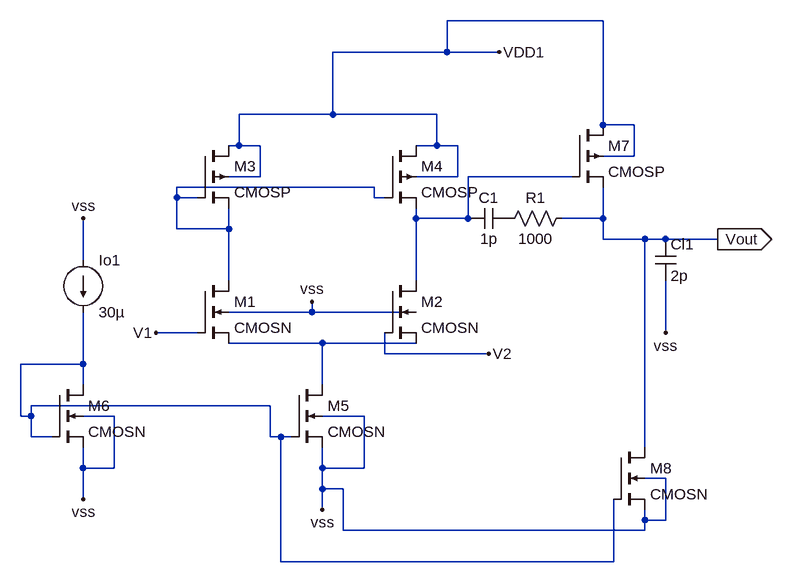
[diagram p0: schematic opamp.asc]
opamp.asc, the LTspice schematic file:
Version 4.1
SHEET 1 1244 804
WIRE 560 -80 320 -80
WIRE 320 -32 320 -80
WIRE 320 -32 144 -32
WIRE 400 -32 320 -32
WIRE 144 64 144 -32
WIRE 144 64 0 64
WIRE 304 64 144 64
WIRE 560 80 560 -80
WIRE 608 80 560 80
WIRE 0 112 0 64
WIRE 0 112 -16 112
WIRE 32 112 0 112
WIRE 304 112 304 64
WIRE 304 112 272 112
WIRE 336 112 304 112
WIRE 608 128 608 80
WIRE 608 128 560 128
WIRE 32 160 32 112
WIRE 32 160 -16 160
WIRE 336 160 336 112
WIRE 336 160 272 160
WIRE 512 160 352 160
WIRE 208 176 -96 176
WIRE -96 192 -96 176
WIRE -64 192 -96 192
WIRE 208 192 208 176
WIRE 224 192 208 192
WIRE 272 224 272 208
WIRE 352 224 352 160
WIRE 352 224 272 224
WIRE 560 224 560 176
WIRE 560 224 496 224
WIRE -96 240 -96 192
WIRE -16 240 -16 208
WIRE -16 240 -96 240
WIRE 560 256 560 224
WIRE 624 256 560 256
WIRE 656 256 624 256
WIRE 736 256 656 256
WIRE -240 288 -240 224
WIRE -16 320 -16 240
WIRE 272 320 272 224
WIRE 112 368 112 352
WIRE 112 368 -16 368
WIRE 272 368 112 368
WIRE -64 400 -128 400
WIRE 656 400 656 320
WIRE 128 416 -16 416
WIRE 272 416 128 416
WIRE 224 432 224 400
WIRE 384 432 224 432
WIRE -240 448 -240 368
WIRE -240 448 -336 448
WIRE -240 480 -240 448
WIRE 128 480 128 416
WIRE 48 512 -320 512
WIRE -336 528 -336 448
WIRE -320 528 -320 512
WIRE -320 528 -336 528
WIRE -192 528 -240 528
WIRE 192 528 128 528
WIRE -320 560 -320 528
WIRE -288 560 -320 560
WIRE 48 560 48 512
WIRE 64 560 48 560
WIRE 80 560 64 560
WIRE 624 576 624 256
WIRE -240 608 -240 576
WIRE -192 608 -192 528
WIRE -192 608 -240 608
WIRE 128 608 128 576
WIRE 192 608 192 528
WIRE 192 608 128 608
WIRE 656 624 624 624
WIRE 128 640 128 608
WIRE 160 640 128 640
WIRE -240 656 -240 608
WIRE 128 672 128 640
WIRE 624 688 624 672
WIRE 656 688 656 624
WIRE 656 688 624 688
WIRE 160 704 160 640
WIRE 624 704 624 688
WIRE 624 704 160 704
WIRE 64 752 64 560
WIRE 576 752 576 656
WIRE 576 752 64 752
FLAG 736 256 Vout
IOPIN 736 256 Out
FLAG -240 224 vss
FLAG -240 656 vss
FLAG 112 352 vss
FLAG 128 672 vss
FLAG 656 400 vss
FLAG 384 432 V2
FLAG -128 400 V1
FLAG 400 -32 VDD1
SYMBOL cmosn -64 320 R0
SYMATTR InstName M1
SYMATTR Value2 l=1u w=5u
SYMBOL cmosn 224 320 R0
SYMATTR InstName M2
SYMATTR Value2 l=1u w=5u
SYMBOL cmosp -64 112 R0
SYMATTR InstName M3
SYMATTR Value2 l=1u w=6u
SYMBOL cmosp 224 112 R0
SYMATTR InstName M4
SYMATTR Value2 l=1u w=6u
SYMBOL cmosn 80 480 R0
SYMATTR InstName M5
SYMATTR Value2 l=1u w=4.2u
SYMBOL cmosn -288 480 R0
SYMATTR InstName M6
SYMATTR Value2 l=1u w=4.2u
SYMBOL current -240 288 R0
WINDOW 123 0 0 Left 0
WINDOW 39 0 0 Left 0
SYMATTR InstName Io1
SYMATTR Value 30µ
SYMBOL cap 640 256 R0
SYMATTR InstName Cl1
SYMATTR Value 2p
SYMBOL cmosp 512 80 R0
SYMATTR InstName M7
SYMATTR Value2 l=1u w=85u
SYMBOL cap 416 208 R90
WINDOW 0 0 32 VBottom 2
WINDOW 3 32 32 VTop 2
SYMATTR InstName C1
SYMATTR Value 1p
SYMBOL cmosn 576 576 R0
SYMATTR InstName M8
SYMATTR Value2 l=1u w=30u
SYMBOL res 512 208 R90
WINDOW 0 0 56 VBottom 2
WINDOW 3 32 56 VTop 2
SYMATTR InstName R1
SYMATTR Value 1000

The netlist it stands for:
* opamp.asc
M1 N002 V1 N003 vss CMOSN l=1u w=5u
M2 N001 V2 N003 vss CMOSN l=1u w=5u
M3 VDD1 N002 N002 VDD1 CMOSP l=1u w=6u
M4 VDD1 N002 N001 VDD1 CMOSP l=1u w=6u
M5 N003 N004 vss vss CMOSN l=1u w=4.2u
M6 N004 N004 vss vss CMOSN l=1u w=4.2u
Io1 vss N004 30µ
Cl1 Vout vss 2p
M7 VDD1 N001 Vout VDD1 CMOSP l=1u w=85u
C1 P001 N001 1p
M8 Vout N004 vss vss CMOSN l=1u w=30u
R1 Vout P001 1000
.model NMOS NMOS
.model PMOS PMOS
.lib standard.mos
.backanno
.end